# EAGLE design Sensor2 (EAGLE 7.6.0)
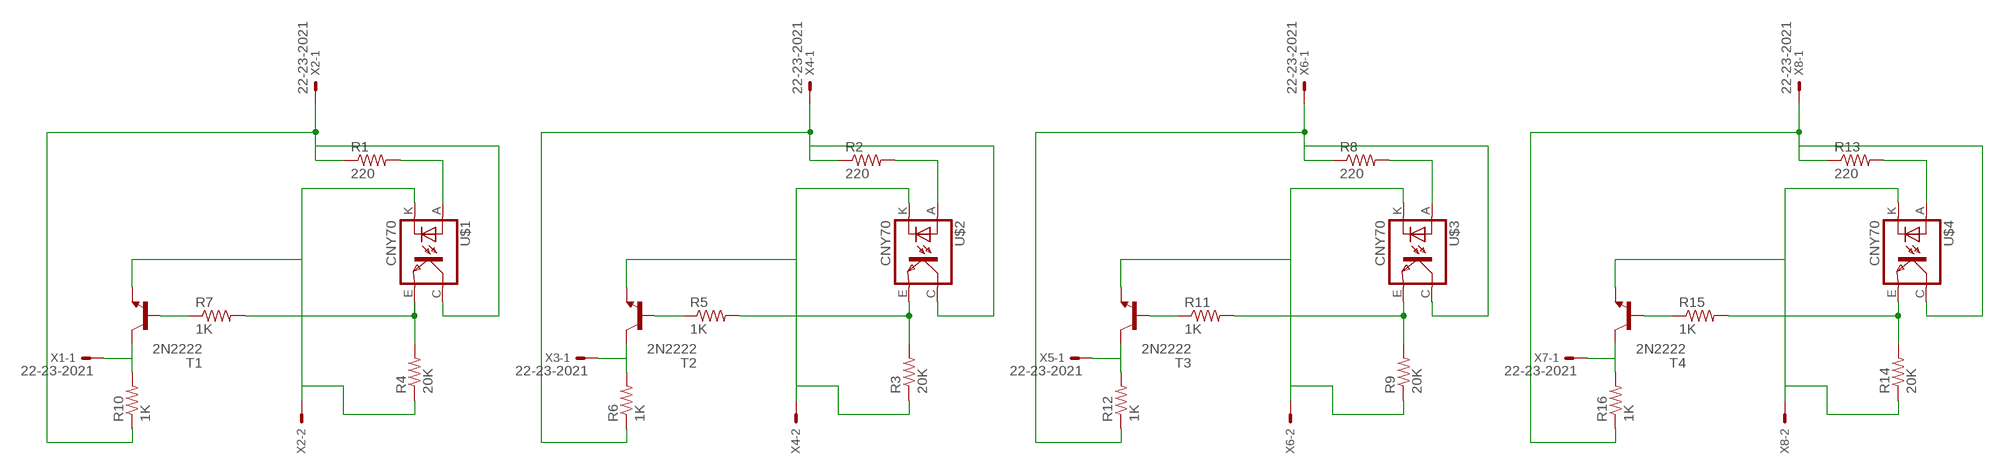
[diagram p0: schematic, sheet 1]

## Parts
R1  220  R-US_0204/7  [0204/7]
R2  220  R-US_0204/7  [0204/7]
R3  20K  R-US_0204/7  [0204/7]
R4  20K  R-US_0204/7  [0204/7]
R5  1K  R-US_0204/7  [0204/7]
R6  1K  R-US_0204/7  [0204/7]
R7  1K  R-US_0204/7  [0204/7]
R8  220  R-US_0204/7  [0204/7]
R9  20K  R-US_0204/7  [0204/7]
R10  1K  R-US_0204/7  [0204/7]
R11  1K  R-US_0204/7  [0204/7]
R12  1K  R-US_0204/7  [0204/7]
R13  220  R-US_0204/7  [0204/7]
R14  20K  R-US_0204/7  [0204/7]
R15  1K  R-US_0204/7  [0204/7]
R16  1K  R-US_0204/7  [0204/7]
T1  2N2222  [TO18]
T2  2N2222  [TO18]
T3  2N2222  [TO18]
T4  2N2222  [TO18]
U$1  CNY70  [4]
U$2  CNY70  [4]
U$3  CNY70  [4]
U$4  CNY70  [4]
X1  22-23-2021  [22-23-2021]
X2  22-23-2021  [22-23-2021]
X3  22-23-2021  [22-23-2021]
X4  22-23-2021  [22-23-2021]
X5  22-23-2021  [22-23-2021]
X6  22-23-2021  [22-23-2021]
X7  22-23-2021  [22-23-2021]
X8  22-23-2021  [22-23-2021]

## Nets
N$1: R1.2 U$1.A
N$2: R4.1 T1.1(E) U$1.K(C) X2.2
N$3: R2.2 U$2.A
N$4: R3.1 T2.1(E) U$2.K(C) X4.2
N$5: R4.2 R7.2 U$1.E(EMI)
N$6: R3.2 R5.2 U$2.E(EMI)
N$7: R10.2 T1.3(C) X1.1
N$8: R7.1 T1.2(B)
N$9: R6.2 T2.3(C) X3.1
N$10: R1.1 R10.1 U$1.C(COL) X2.1
N$11: R5.1 T2.2(B)
N$12: R2.1 R6.1 U$2.C(COL) X4.1
N$13: R8.2 U$3.A
N$14: R9.1 T3.1(E) U$3.K(C) X6.2
N$15: R9.2 R11.2 U$3.E(EMI)
N$16: R12.2 T3.3(C) X5.1
N$17: R11.1 T3.2(B)
N$18: R8.1 R12.1 U$3.C(COL) X6.1
N$19: R13.2 U$4.A
N$20: R14.1 T4.1(E) U$4.K(C) X8.2
N$21: R14.2 R15.2 U$4.E(EMI)
N$22: R16.2 T4.3(C) X7.1
N$23: R15.1 T4.2(B)
N$24: R13.1 R16.1 U$4.C(COL) X8.1
Unconnected: X1.2 X3.2 X5.2 X7.2

## Library data of the parts
R1-R16 = resistor:R-US_: RESISTOR, American symbol
T1-T4 = transistor:2N2222: NPN TRANSISTOR
U$1-U$4 = cny70:CNY70
X1-X8 = con-molex:22-23-2021: .100" (2.54mm) Center Header - 2 Pin; MF: MOLEX; MPN: 22-23-2021; OC_FARNELL: 1462926; OC_NEWARK: 25C3832

## Board
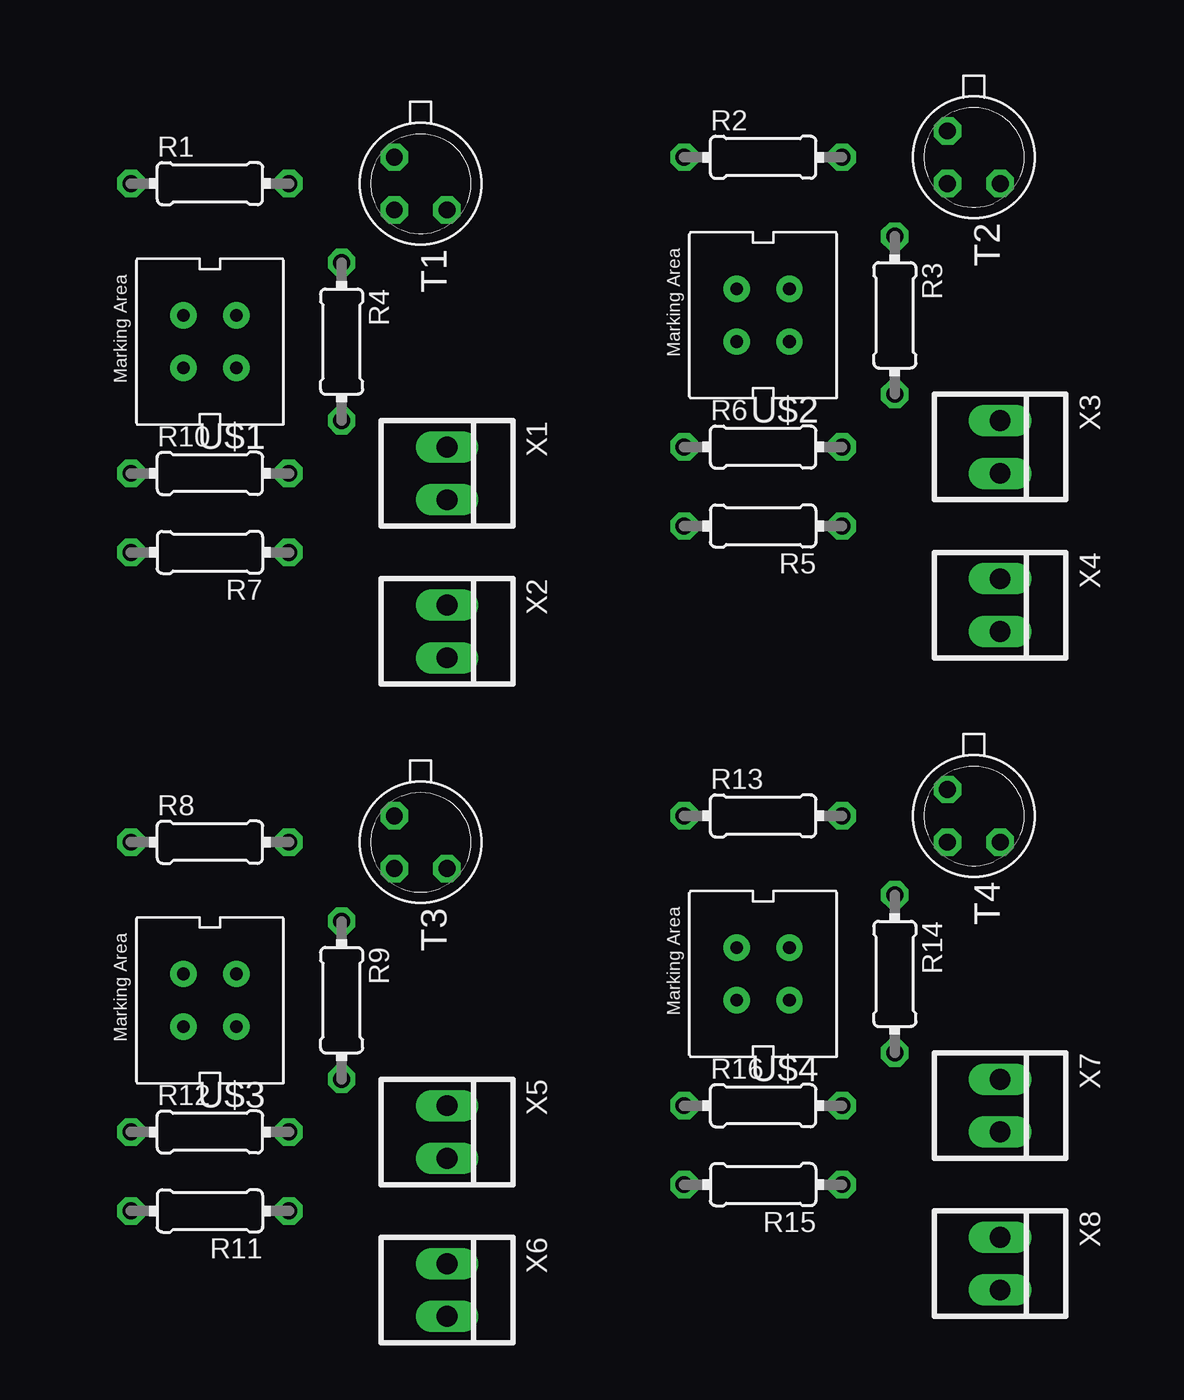
[diagram p1: board, top side]
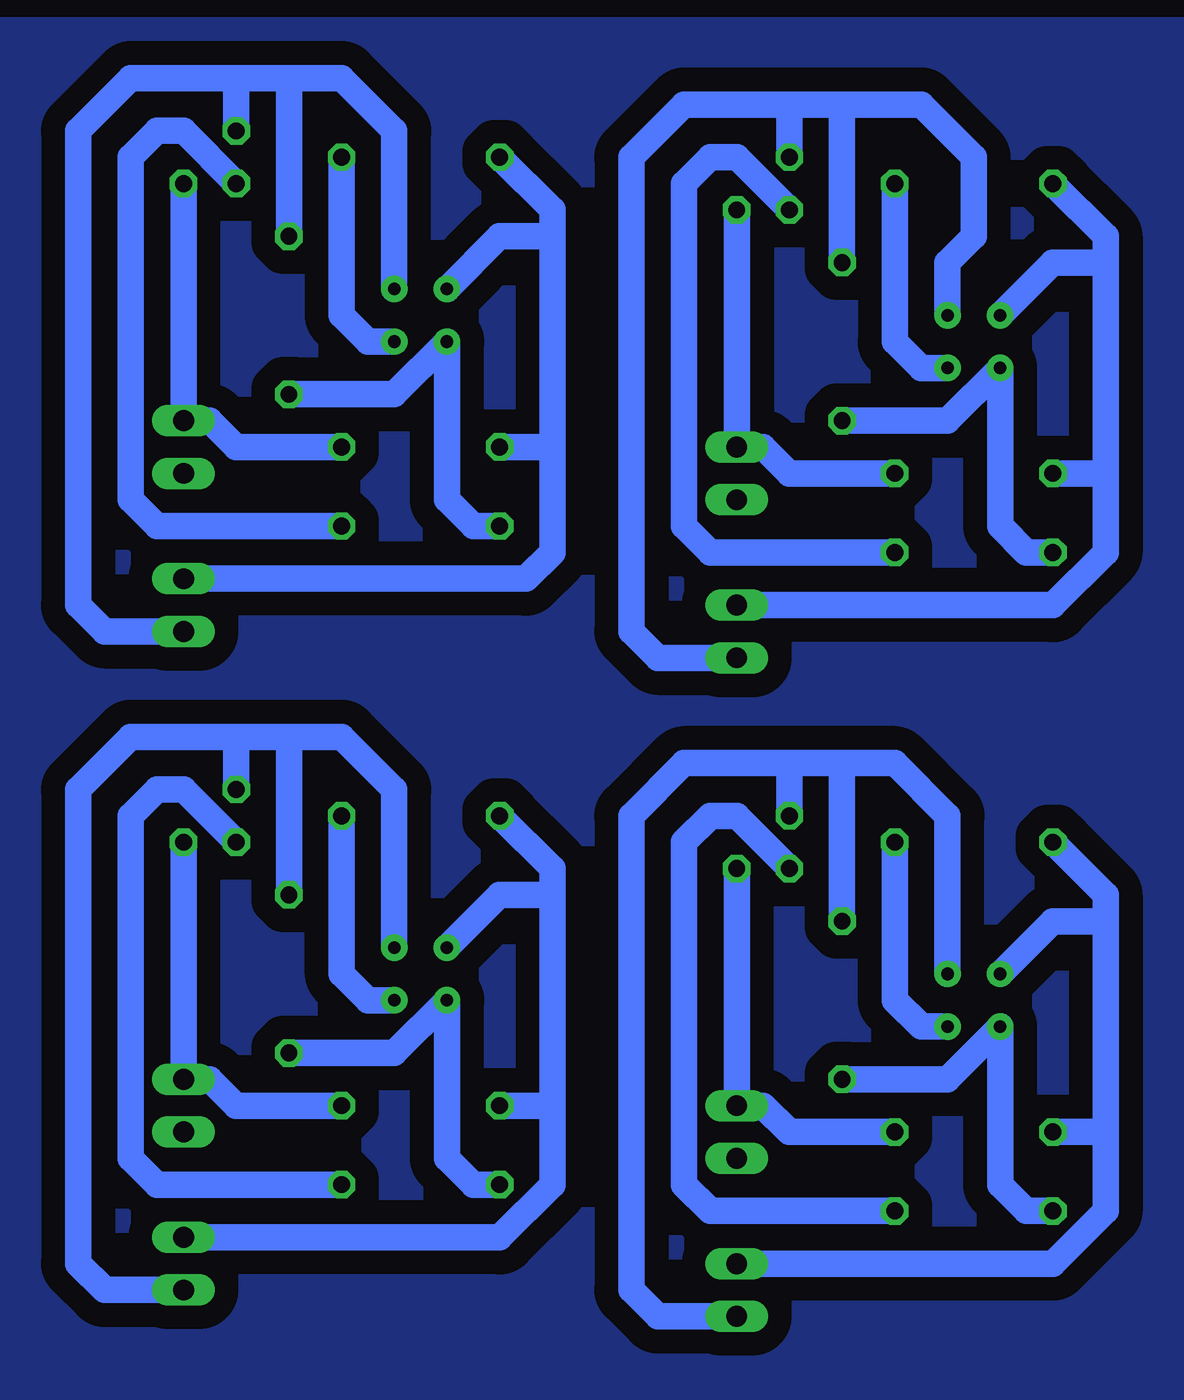
[diagram p2: board, bottom side, seen from below]

No outline drawn. Coordinates in mm, seen from the top.
Copper layers (1*16): Top 0.035mm / dielectric 1.5mm / Bottom 0.035mm
Design rules "default *": minimum track width 50mil, minimum drill 28mil, track to track 18mil, track to pad 18mil, pad to pad 8mil, via to via 8mil, smd to smd 8mil, copper to edge 80mil, drill to drill 8mil, minimum pad ring 10mil, minimum via ring 8mil, stop-mask expansion 4mil, vias tented up to drill 0mil, thermal gap 10mil

### Footprints (pad centres in the part's own frame; a part is rotated, then mirrored left to right if it is on the bottom)
0204/7 = drill 0.813 octagon: 1 -3.81,0; 2 3.81,0
TO18 = drill 0.813 octagon: 1 -1.27,-1.27; 2 1.27,-1.27; 3 1.27,1.27
4 = drill 0.61 pad 1.27: A -1.27,1.27; C 1.27,-1.27; E 1.27,1.27; K -1.27,-1.27
22-23-2021 = drill 1 long: 1 -1.27,0; 2 1.27,0

### Placement (x,y rotation side)
R1  -7.62,44.45 0 top
R2  19.05,45.72 0 top
R3  25.4,38.1 270 top
R4  -1.27,36.83 270 top
R5  19.05,27.94 180 top
R6  19.05,31.75 0 top
R7  -7.62,26.67 180 top
R8  -7.62,12.7 0 top
R9  -1.27,5.08 270 top
R10  -7.62,30.48 0 top
R11  -7.62,-5.08 180 top
R12  -7.62,-1.27 0 top
R13  19.05,13.97 0 top
R14  25.4,6.35 270 top
R15  19.05,-3.81 180 top
R16  19.05,0 0 top
T1  2.54,44.45 270 top
T2  29.21,45.72 270 top
T3  2.54,12.7 270 top
T4  29.21,13.97 270 top
U$1  -7.62,36.83 180 top
U$2  19.05,38.1 180 top
U$3  -7.62,5.08 180 top
U$4  19.05,6.35 180 top
X1  3.81,30.48 270 top
X2  3.81,22.86 270 top
X3  30.48,31.75 270 top
X4  30.48,24.13 270 top
X5  3.81,-1.27 270 top
X6  3.81,-8.89 270 top
X7  30.48,0 270 top
X8  30.48,-7.62 270 top

### Tracks (layer width: path | path; a pad name or v marks a point on that pad's centre or on a via)
N$1
  Bottom 1.27: R1.2 -3.81,36.83 -5.08,35.56 U$1.A
N$2
  Bottom 1.27: U$1.K -6.35,40.64 -7.62,41.91 -7.62,45.72 -5.08,48.26 -1.27,48.26 | X2.2 7.62,21.59 8.89,22.86 8.89,45.72 6.35,48.26 1.27,48.26 | -1.27,48.26 1.27,48.26 | T1.1 1.27,48.26 | R4.1 -1.27,48.26
N$3
  Bottom 1.27: R2.2 22.86,38.1 21.59,36.83 U$2.A
N$4
  Bottom 1.27: U$2.K 20.32,46.99 22.86,49.53 25.4,49.53 | 25.4,49.53 27.94,49.53 | 27.94,49.53 33.02,49.53 35.56,46.99 35.56,24.13 34.29,22.86 X4.2 | T2.1 27.94,49.53 | R3.1 25.4,49.53
N$5
  Bottom 1.27: R4.2 -6.35,33.02 U$1.E -8.89,27.94 -10.16,26.67 R7.2
N$6
  Bottom 1.27: R5.2 16.51,27.94 17.78,29.21 U$2.E 20.32,34.29 R3.2
N$7
  Bottom 1.27: R10.2 1.27,30.48 2.54,31.75 X1.1 T1.3
N$8
  Bottom 1.27: R7.1 5.08,26.67 6.35,27.94 6.35,44.45 5.08,45.72 3.81,45.72 T1.2
N$9
  Bottom 1.27: T2.3 X3.1 29.21,33.02 27.94,31.75 R6.2
N$10
  Bottom 1.27: R1.1 -13.97,41.91 -13.97,40.64 | -13.97,40.64 -13.97,30.48 | -13.97,30.48 -13.97,26.67 -11.43,24.13 X2.1 | R10.1 -13.97,30.48 | U$1.C -11.43,40.64 -13.97,40.64
N$11
  Bottom 1.27: T2.2 30.48,46.99 31.75,46.99 33.02,45.72 33.02,29.21 31.75,27.94 R5.1
N$12
  Bottom 1.27: R2.1 12.7,43.18 12.7,41.91 | 12.7,41.91 12.7,31.75 | 12.7,31.75 12.7,26.67 13.97,25.4 X4.1 | R6.1 12.7,31.75 | U$2.C 15.24,41.91 12.7,41.91
N$13
  Bottom 1.27: U$3.A -5.08,3.81 -3.81,5.08 R8.2
N$14
  Bottom 1.27: U$3.K -6.35,13.97 -3.81,16.51 -1.27,16.51 | -1.27,16.51 1.27,16.51 | 1.27,16.51 6.35,16.51 8.89,13.97 8.89,-8.89 7.62,-10.16 X6.2 | R9.1 -1.27,16.51 | T3.1 1.27,16.51
N$15
  Bottom 1.27: R11.2 -10.16,-5.08 -8.89,-3.81 U$3.E -6.35,1.27 R9.2
N$16
  Bottom 1.27: R12.2 1.27,-1.27 2.54,0 X5.1 T3.3
N$17
  Bottom 1.27: T3.2 3.81,13.97 5.08,13.97 6.35,12.7 6.35,-3.81 5.08,-5.08 R11.1
N$18
  Bottom 1.27: R8.1 -13.97,10.16 -13.97,8.89 | -13.97,8.89 -13.97,-1.27 | -13.97,-1.27 -13.97,-5.08 -11.43,-7.62 X6.1 | R12.1 -13.97,-1.27 | U$3.C -11.43,8.89 -13.97,8.89
N$19
  Bottom 1.27: U$4.A 21.59,5.08 22.86,6.35 R13.2
N$20
  Bottom 1.27: U$4.K 20.32,15.24 22.86,17.78 25.4,17.78 | X8.2 34.29,-8.89 35.56,-7.62 35.56,15.24 33.02,17.78 27.94,17.78 | R14.1 25.4,17.78 | 25.4,17.78 27.94,17.78 | T4.1 27.94,17.78
N$21
  Bottom 1.27: R15.2 16.51,-3.81 17.78,-2.54 U$4.E 20.32,2.54 R14.2
N$22
  Bottom 1.27: R16.2 27.94,0 29.21,1.27 X7.1 T4.3
N$23
  Bottom 1.27: T4.2 30.48,15.24 31.75,15.24 33.02,13.97 33.02,-2.54 31.75,-3.81 R15.1
N$24
  Bottom 1.27: R13.1 12.7,11.43 12.7,10.16 | 12.7,10.16 12.7,0 | 12.7,0 12.7,-3.81 15.24,-6.35 X8.1 | R16.1 12.7,0 | U$4.C 15.24,10.16 12.7,10.16
N$25
  pour Bottom (isolate 1.143): -17.78,52.07 40.64,52.07 40.64,-13.97 -17.78,-13.97